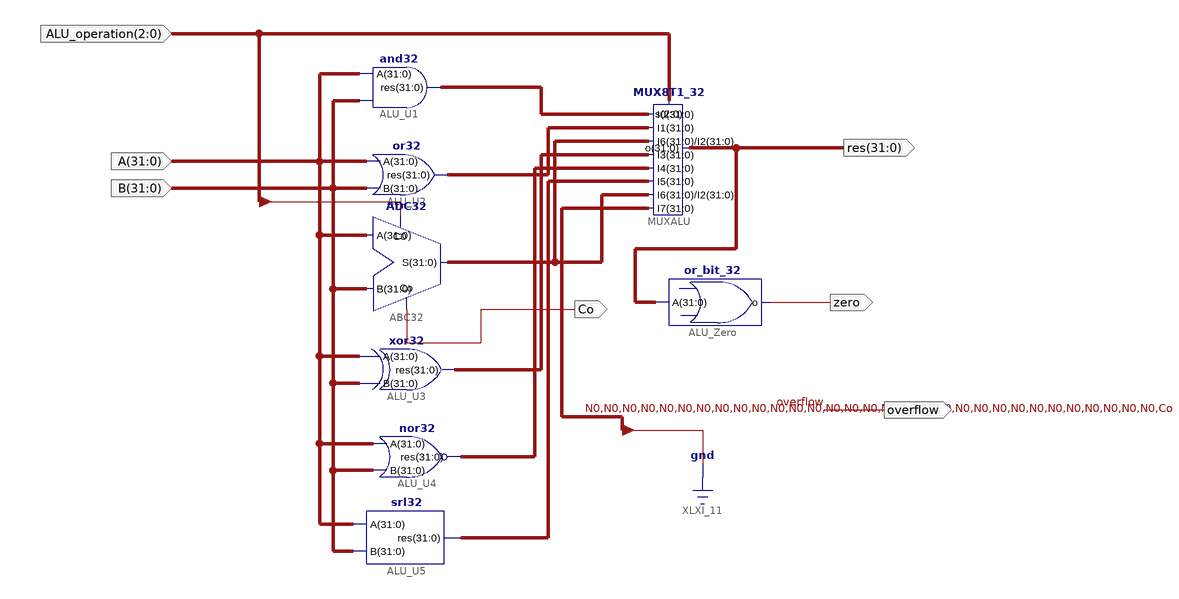
[diagram p0: schematic sheet 1]
// Xilinx ISE schematic alu.sch (kintex7) as structural Verilog: 8 symbols, 7 ports
module alu (
  input  [2:0] ALU_operation,
  input  [31:0] A,
  input  [31:0] B,
  output Co,
  output [31:0] res,
  output zero,
  output overflow
);

  wire [31:0] XLXN_21, XLXN_22, XLXN_23, XLXN_24, XLXN_25, XLXN_26;

  and32 ALU_U1 (.res(XLXN_21), .A(A), .B(B));
  or32 ALU_U2 (.res(XLXN_22), .A(A), .B(B));
  ADC32 ABC32 (.B(B), .A(A), .C0(ALU_operation[2]), .S(XLXN_23), .Co(Co));
  xor32 ALU_U3 (.A(A), .B(B), .res(XLXN_24));
  nor32 ALU_U4 (.res(XLXN_25), .A(A), .B(B));
  srl32 ALU_U5 (.A(A), .B(B), .res(XLXN_26));
  MUX8T1_32 MUXALU (
    .s(ALU_operation), .I7({{31{1'b0}}, Co}), .I6(XLXN_23), .I5(XLXN_26), .I4(XLXN_25), .I3(XLXN_24),
    .I2(XLXN_23), .I1(XLXN_22), .I0(XLXN_21), .o(res));
  or_bit_32 ALU_Zero (.o(zero), .A(res));
endmodule
